# Altium schematic sheet Comunicacion_Serie.SchDoc
size A4; SheetNumber: 10; SheetTotal: 12
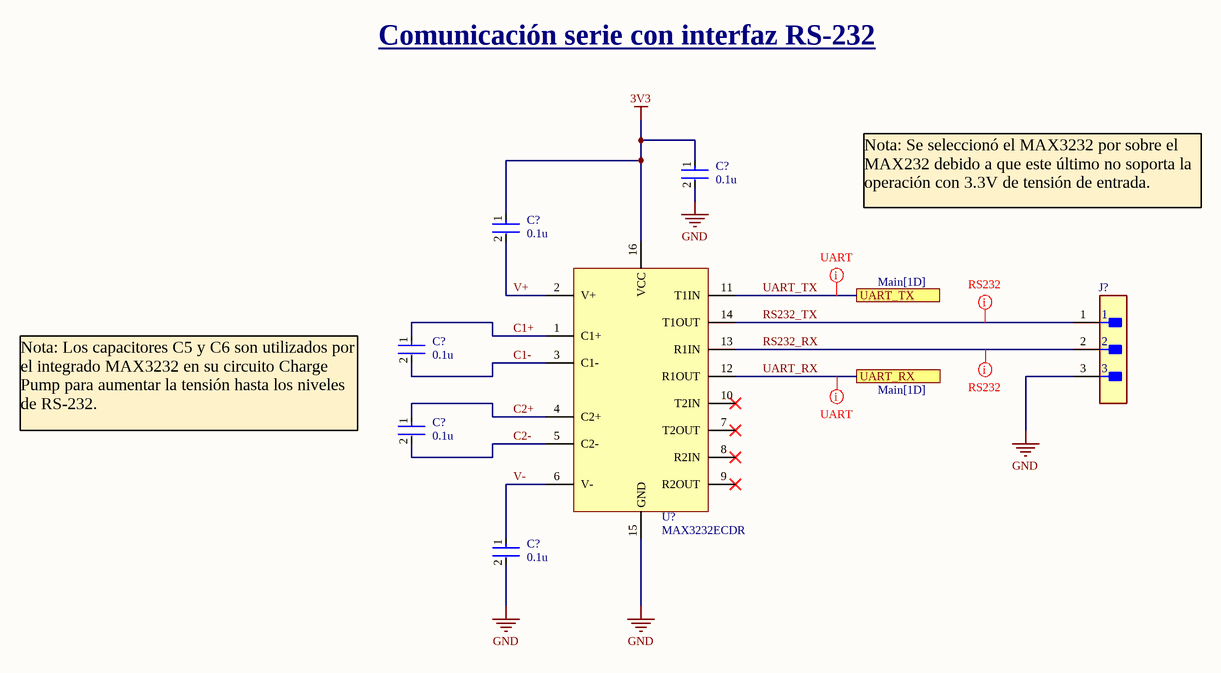
[diagram p0: Comunicacion_Serie.SchDoc]

## Parts
(Parts that share a designator on the sheet are numbered #1, #2 ... from top to bottom, then left to right.)
C?#1  value 0.1u  [FP-CC0805-0_85-MFG]  (hidden comment: CC0805KRX7R8BB104)
C?#2  value 0.1u  [FP-CC0805-0_85-MFG]  (hidden comment: CC0805KRX7R8BB104)
C?#3  value 0.1u  [FP-CC0805-0_85-MFG]  (hidden comment: CC0805KRX7R8BB104)
C?#4  value 0.1u  [FP-CC0805-0_85-MFG]  (hidden comment: CC0805KRX7R8BB104)
C?#5  value 0.1u  [FP-CC0805-0_85-MFG]  (hidden comment: CC0805KRX7R8BB104)
J?  22-11-1031  [FP-0022111031-MFG]  (value not drawn)
U?  MAX3232ECDR  [D0016A_M]

## Ports
UART_RX (see Main[1D]), UART_TX (see Main[1D])

## Nets
3V3: C?#1.1 C?#2.1 U?.16(VCC)
GND: C?#1.2 C?#5.2 J?.3 U?.15(GND)
C1+: C?#3.1 U?.1(C1+)
C1-: C?#3.2 U?.3(C1-)
C2+: C?#4.1 U?.4(C2+)
C2-: C?#4.2 U?.5(C2-)
RS232_RX: J?.2 U?.13(R1IN)
RS232_TX: J?.1 U?.14(T1OUT)
UART_RX: U?.12(R1OUT) ; port UART_RX
UART_TX: U?.11(T1IN) ; port UART_TX
V+: C?#2.2 U?.2(V+)
V-: C?#5.1 U?.6(V-)

Not connected (* = marked no-connect by the designer): U? 7(T2OUT)* 8(R2IN)* 9(R2OUT)* 10(T2IN)*

## Layout directives
mark named UART: UART_RX, UART_TX
mark named RS232: RS232_RX, RS232_TX

## Notes on the sheet
- Comunicación serie con interfaz RS-232
- Nota: Se seleccionó el MAX3232 por sobre el MAX232 debido a que este último no soporta la operación con 3.3V de tensión de entrada.
- Nota: Los capacitores C5 y C6 son utilizados por el integrado MAX3232 en su circuito Charge Pump para aumentar la tensión hasta los niveles de RS-232.

## Library data of the parts
C?#1-C?#5 = CMP-1036-04410-2: CAP CER 0.1UF 25V X7R 0805; Manufacturer: Yageo; Tolerance: 0.1; Material: Ceramic; Capacitance: 100 nF; ComponentLink2URL: http://www.yageo.com/documents/recent/UPY-GPHC_Y5V_6.3V-to-50V_8.pdf; Category: Cap; Mouser Description: Multilayer Ceramic Capacitors MLCC - SMD/SMT 100nF 25V X7R 10%; Manufacturer Part Number: CC0805KRX7R8BB104; Device Class L1: Passive Components; Footprint Url: http://www.yageo.com/exep/pages/download/literatures/UPY-C_GEN_24.pdf; Height: 0.95mm; Digikey Description: CAP CER 0.1UF 25V X7R 0805; Lead Free: Yes; Temperature Range High: +85°C; Temperature: -30°C to +85°C; Ipc Land Pattern Name: CAPC200125X85; Automotive: No; Octopart: https://octopart.com/cc0805krx7r8bb104-yageo-39467766; Device Class L2: Capacitors; Temperature Characteristic: X7R; Voltage Rating: 25 V; ComponentLink2Description: Datasheet; Temperature Range Low: -30°C; Device Class L3: Ceramic Capacitors; RoHS: TRUE; Package: CC0805-0.85
J? = CMP-00257-00247512-1: 22-11-1031 Mini-Latch™ Wire-to-Board Header, Vertical, with Friction Ramp, 3 Circuits, Gold (Au) Plating; Manufacturer Lifecycle Status: ACTIVE; NexarPartId: 247512; Number of Positions: 3; Current Rating: 3A; Gender: Male; Pitch: 2.5mm; Connector Type: Male Pin; Contact Resistance: 20mΩ; Voltage Rating: 250V; Max Voltage Rating (DC): 250.25kV; Color: Natural; Fastening Type: Friction; RoHS: Compliant; Contact Mating Length: 7.493mm; Lifecycle Status: Production; Number of Rows: 1; Schedule B: 8536694040, 8536694040; Radiation Hardening: No; Number of Contacts: 3; Depth: 4.9mm; Termination: Solder; Housing Color: Natural; Max Operating Temperature: 105°C; Mount: Through Hole; Height: 12.1mm; Lead Free: Lead Free; Contact Gender: Male; Plating: Gold; Contact Material: Brass; Length: 7mm; Country of Origin: KR; Housing Material: Nylon; Number of Circuits: 3; Contact Plating: Gold; Packaging: Bulk; Orientation: Vertical; Min Operating Temperature: -40°C; REACH SVHC: Unknown